# Altium schematic sheet SD Card.SchDoc
size A4; SheetNumber: 7; SheetTotal: 9
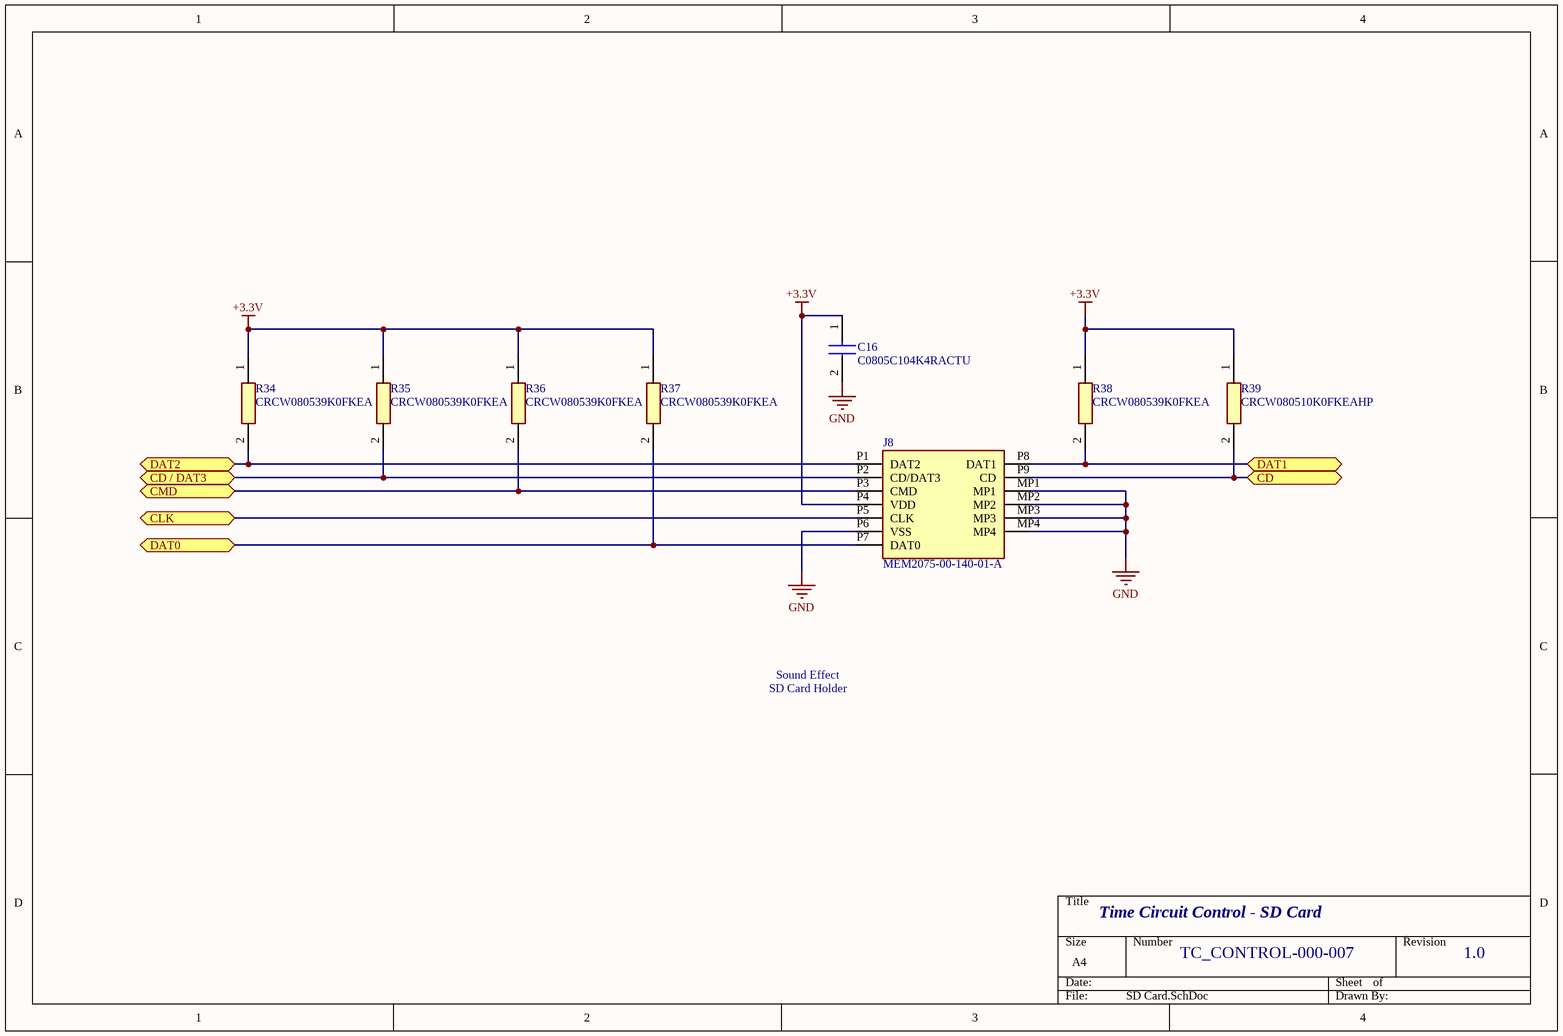
[diagram p0: SD Card.SchDoc]

## Parts
C16  C0805C104K4RACTU  [CAPC2012X88N]
J8  MEM2075-00-140-01-A  [MEM20750014001A]
R34  CRCW080539K0FKEA  [RESC2012X50N]
R35  CRCW080539K0FKEA  [RESC2012X50N]
R36  CRCW080539K0FKEA  [RESC2012X50N]
R37  CRCW080539K0FKEA  [RESC2012X50N]
R38  CRCW080539K0FKEA  [RESC2012X50N]
R39  CRCW080510K0FKEAHP  [RESC2012X60N]

## Ports
CD, CD / DAT3, CLK, CMD, DAT0, DAT1, DAT2

## Nets
+3.3V: C16.1 J8.P4(VDD) R34.1 R35.1 R36.1 R37.1 R38.1 R39.1
GND: C16.2 J8.MP1 J8.MP2 J8.MP3 J8.MP4 J8.P6(VSS)
CD: J8.P9(CD) R39.2 ; port CD
CD / DAT3: J8.P2(CD/DAT3) R35.2 ; port CD / DAT3
CLK: J8.P5(CLK) ; port CLK
CMD: J8.P3(CMD) R36.2 ; port CMD
DAT0: J8.P7(DAT0) R37.2 ; port DAT0
DAT1: J8.P8(DAT1) R38.2 ; port DAT1
DAT2: J8.P1(DAT2) R34.2 ; port DAT2

## Notes on the sheet
- Sound Effect
  SD Card Holder
- Time Circuit Control - SD Card
- TC_CONTROL-000-007
- 1.0

## Library data of the parts
C16 = C0805C104K4RACTU: Capacitor; Manufacturer_Name: Kemet; Datasheet Link: http://docs-emea.rs-online.com/webdocs/134c/0900766b8134ce68.pdf; Height: 0.88mm; Manufacturer_Part_Number: C0805C104K4RACTU; Arrow Part Number: C0805C104K4RACTU; Arrow Price/Stock: https://www.arrow.com/en/products/c0805c104k4ractu/kemet-corporation; Mouser Part Number: 80-C0805C104K4R; Mouser Price/Stock: https://www.mouser.co.uk/ProductDetail/KEMET/C0805C104K4RACTU?qs=Pc30aiB8zWWfqQNJWggt%252BA%3D%3D
J8 = MEM2075-00-140-01-A: Connector; Manufacturer_Name: GCT (GLOBAL CONNECTOR TECHNOLOGY); Datasheet Link: http://www.farnell.com/cad/2606866.pdf; Height: 1.45mm; Manufacturer_Part_Number: MEM2075-00-140-01-A; Mouser Part Number: 640-MEM20750014001A; Mouser Price/Stock: https://www.mouser.co.uk/ProductDetail/GCT/MEM2075-00-140-01-A?qs=KUoIvG%2F9IlZvfWpeERlq3Q%3D%3D
R34-R38 = CRCW080539K0FKEA: Resistor; Manufacturer_Name: Vishay; Datasheet Link: http://www.vishay.com/docs/20035/dcrcwe3.pdf; Height: 0.5mm; Manufacturer_Part_Number: CRCW080539K0FKEA; Arrow Part Number: CRCW080539K0FKEA; Mouser Part Number: 71-CRCW080539K0FKEA; Mouser Price/Stock: https://www.mouser.co.uk/ProductDetail/Vishay-Dale/CRCW080539K0FKEA?qs=kJXytlGtIWlXWBq67QQPjA%3D%3D
R39 = CRCW080510K0FKEAHP: Resistor; Manufacturer_Name: Vishay; Datasheet Link: https://componentsearchengine.com/Datasheets/1/CRCW08051R00FKEAHP.pdf; Height: 0.6mm; Manufacturer_Part_Number: CRCW080510K0FKEAHP; Mouser Part Number: 71-CRCW080510K0FKEAH; Mouser Price/Stock: https://www.mouser.co.uk/ProductDetail/Vishay-Dale/CRCW080510K0FKEAHP/?qs=FlFvgi4rxBybVOW6oiRQjA%3D%3D; Arrow Part Number: CRCW080510K0FKEAHP; Arrow Price/Stock: https://www.arrow.com/en/products/crcw080510k0fkeahp/vishay